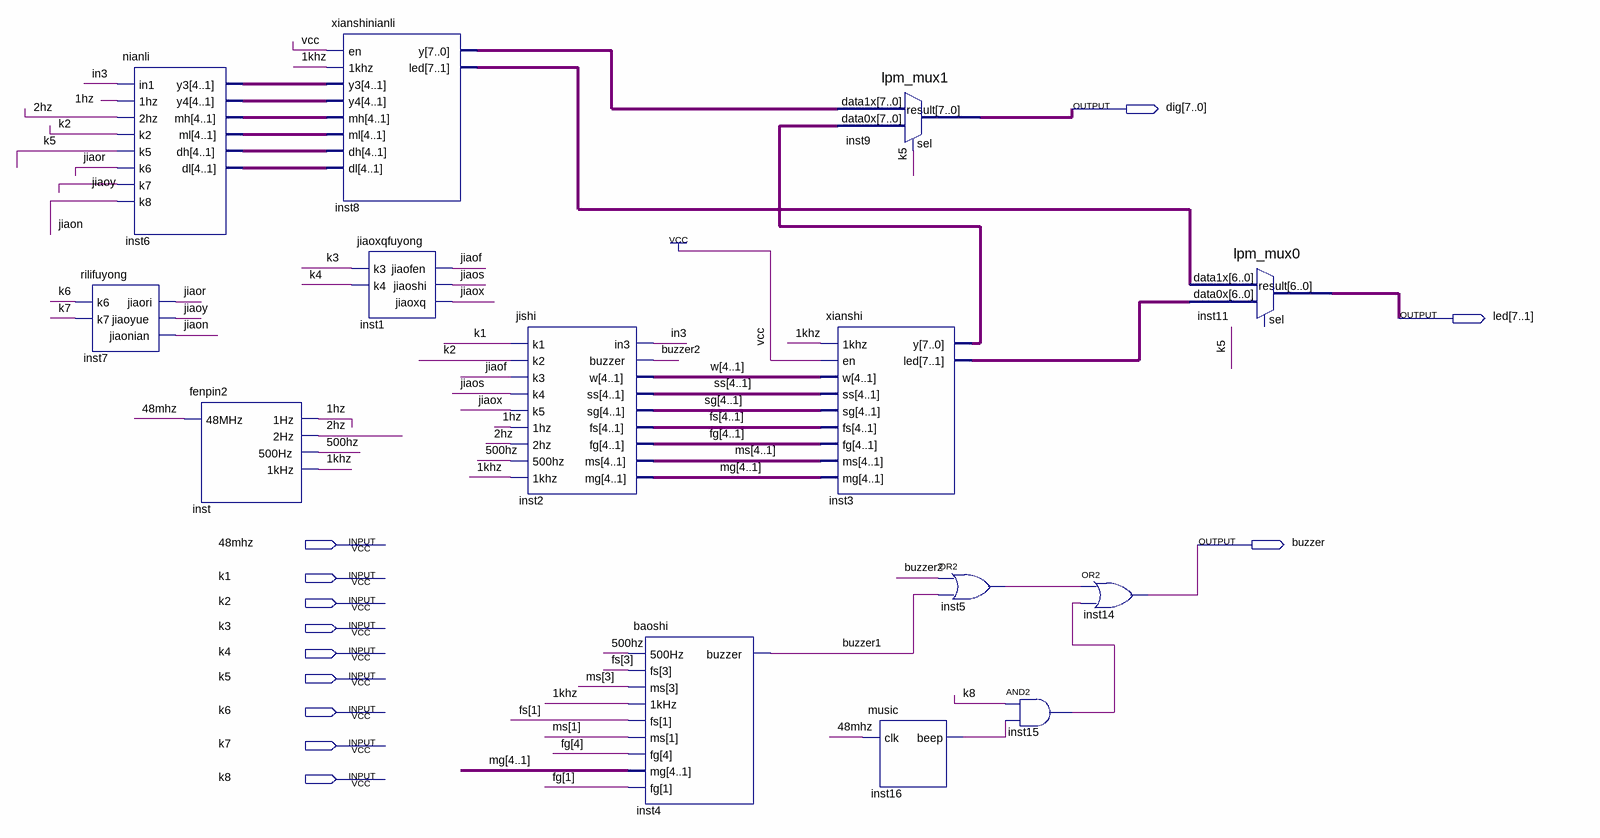
[diagram p0: schematic sheet]
// Quartus schematic all.bdf as structural Verilog: 14 symbols, 12 pins
module all (
  input  \48mhz ,
  input  k1,
  input  k2,
  input  k3,
  input  k4,
  input  k5,
  input  k6,
  input  k7,
  input  k8,
  output [7:0] dig,
  output [7:1] led,
  output buzzer
);

  wire \1hz , \1khz , \2hz , \500hz , buzzer1, buzzer2, in3, inst5_out, inst15_out, inst16_beep, jiaof,
       jiaon, jiaor, jiaos, jiaox, jiaoy;
  wire [3:0] inst6_dh, inst6_dl, inst6_mh, inst6_ml, inst6_y3, inst6_y4;
  wire [4:1] fg, fs, mg, ms, sg, ss, w;
  wire [6:0] inst3_led, inst8_led;
  wire [7:0] inst3_y, inst8_y;

  rilifuyong inst7 (.k6(k6), .k7(k7), .jiaori(jiaor), .jiaoyue(jiaoy), .jiaonian(jiaon));
  nianli inst6 (
    .in1(in3), .\1hz (\1hz ), .\2hz (\2hz ), .k2(k2), .k5(k5), .k6(jiaor), .k7(jiaoy), .k8(jiaon),
    .y3(inst6_y3), .y4(inst6_y4), .mh(inst6_mh), .ml(inst6_ml), .dh(inst6_dh), .dl(inst6_dl));
  fenpin2 inst (.\48MHz (\48mhz ), .\1Hz (\1hz ), .\2Hz (\2hz ), .\500Hz (\500hz ), .\1kHz (\1khz ));
  xianshinianli inst8 (
    .en(1'b1), .\1khz (\1khz ), .y3(inst6_y3), .y4(inst6_y4), .mh(inst6_mh), .ml(inst6_ml), .dh(inst6_dh),
    .dl(inst6_dl), .y(inst8_y), .led(inst8_led));
  jiaoxqfuyong inst1 (.k3(k3), .k4(k4), .jiaofen(jiaof), .jiaoshi(jiaos), .jiaoxq(jiaox));
  jishi inst2 (
    .k1(k1), .k2(k2), .k3(jiaof), .k4(jiaos), .k5(jiaox), .\1hz (\1hz ), .\2hz (\2hz ), .\500hz (\500hz ),
    .\1khz (\1khz ), .in3(in3), .buzzer(buzzer2), .w(w), .ss(ss), .sg(sg), .fs(fs), .fg(fg), .ms(ms), .mg(mg));
  baoshi inst4 (
    .\500Hz (\500hz ), .fs({fs[3], fs[1]}), .ms({ms[3], ms[1]}), .\1kHz (\1khz ), .fg({fg[4], fg[1]}),
    .mg(mg), .buzzer(buzzer1));
  xianshi inst3 (
    .\1khz (\1khz ), .en(1'b1), .w(w), .ss(ss), .sg(sg), .fs(fs), .fg(fg), .ms(ms), .mg(mg), .y(inst3_y),
    .led(inst3_led));
  lpm_mux1 inst9 (.data1x(inst8_y), .data0x(inst3_y), .sel(k5), .result(dig));
  music inst16 (.clk(\48mhz ), .beep(inst16_beep));
  or inst5 (inst5_out, buzzer2, buzzer1);
  and inst15 (inst15_out, k8, inst16_beep);
  or inst14 (buzzer, inst5_out, inst15_out);
  lpm_mux0 inst11 (.data1x(inst8_led), .data0x(inst3_led), .result(led));  // open: sel
endmodule
